# EAGLE design Or'ing (EAGLE 6.5.0)
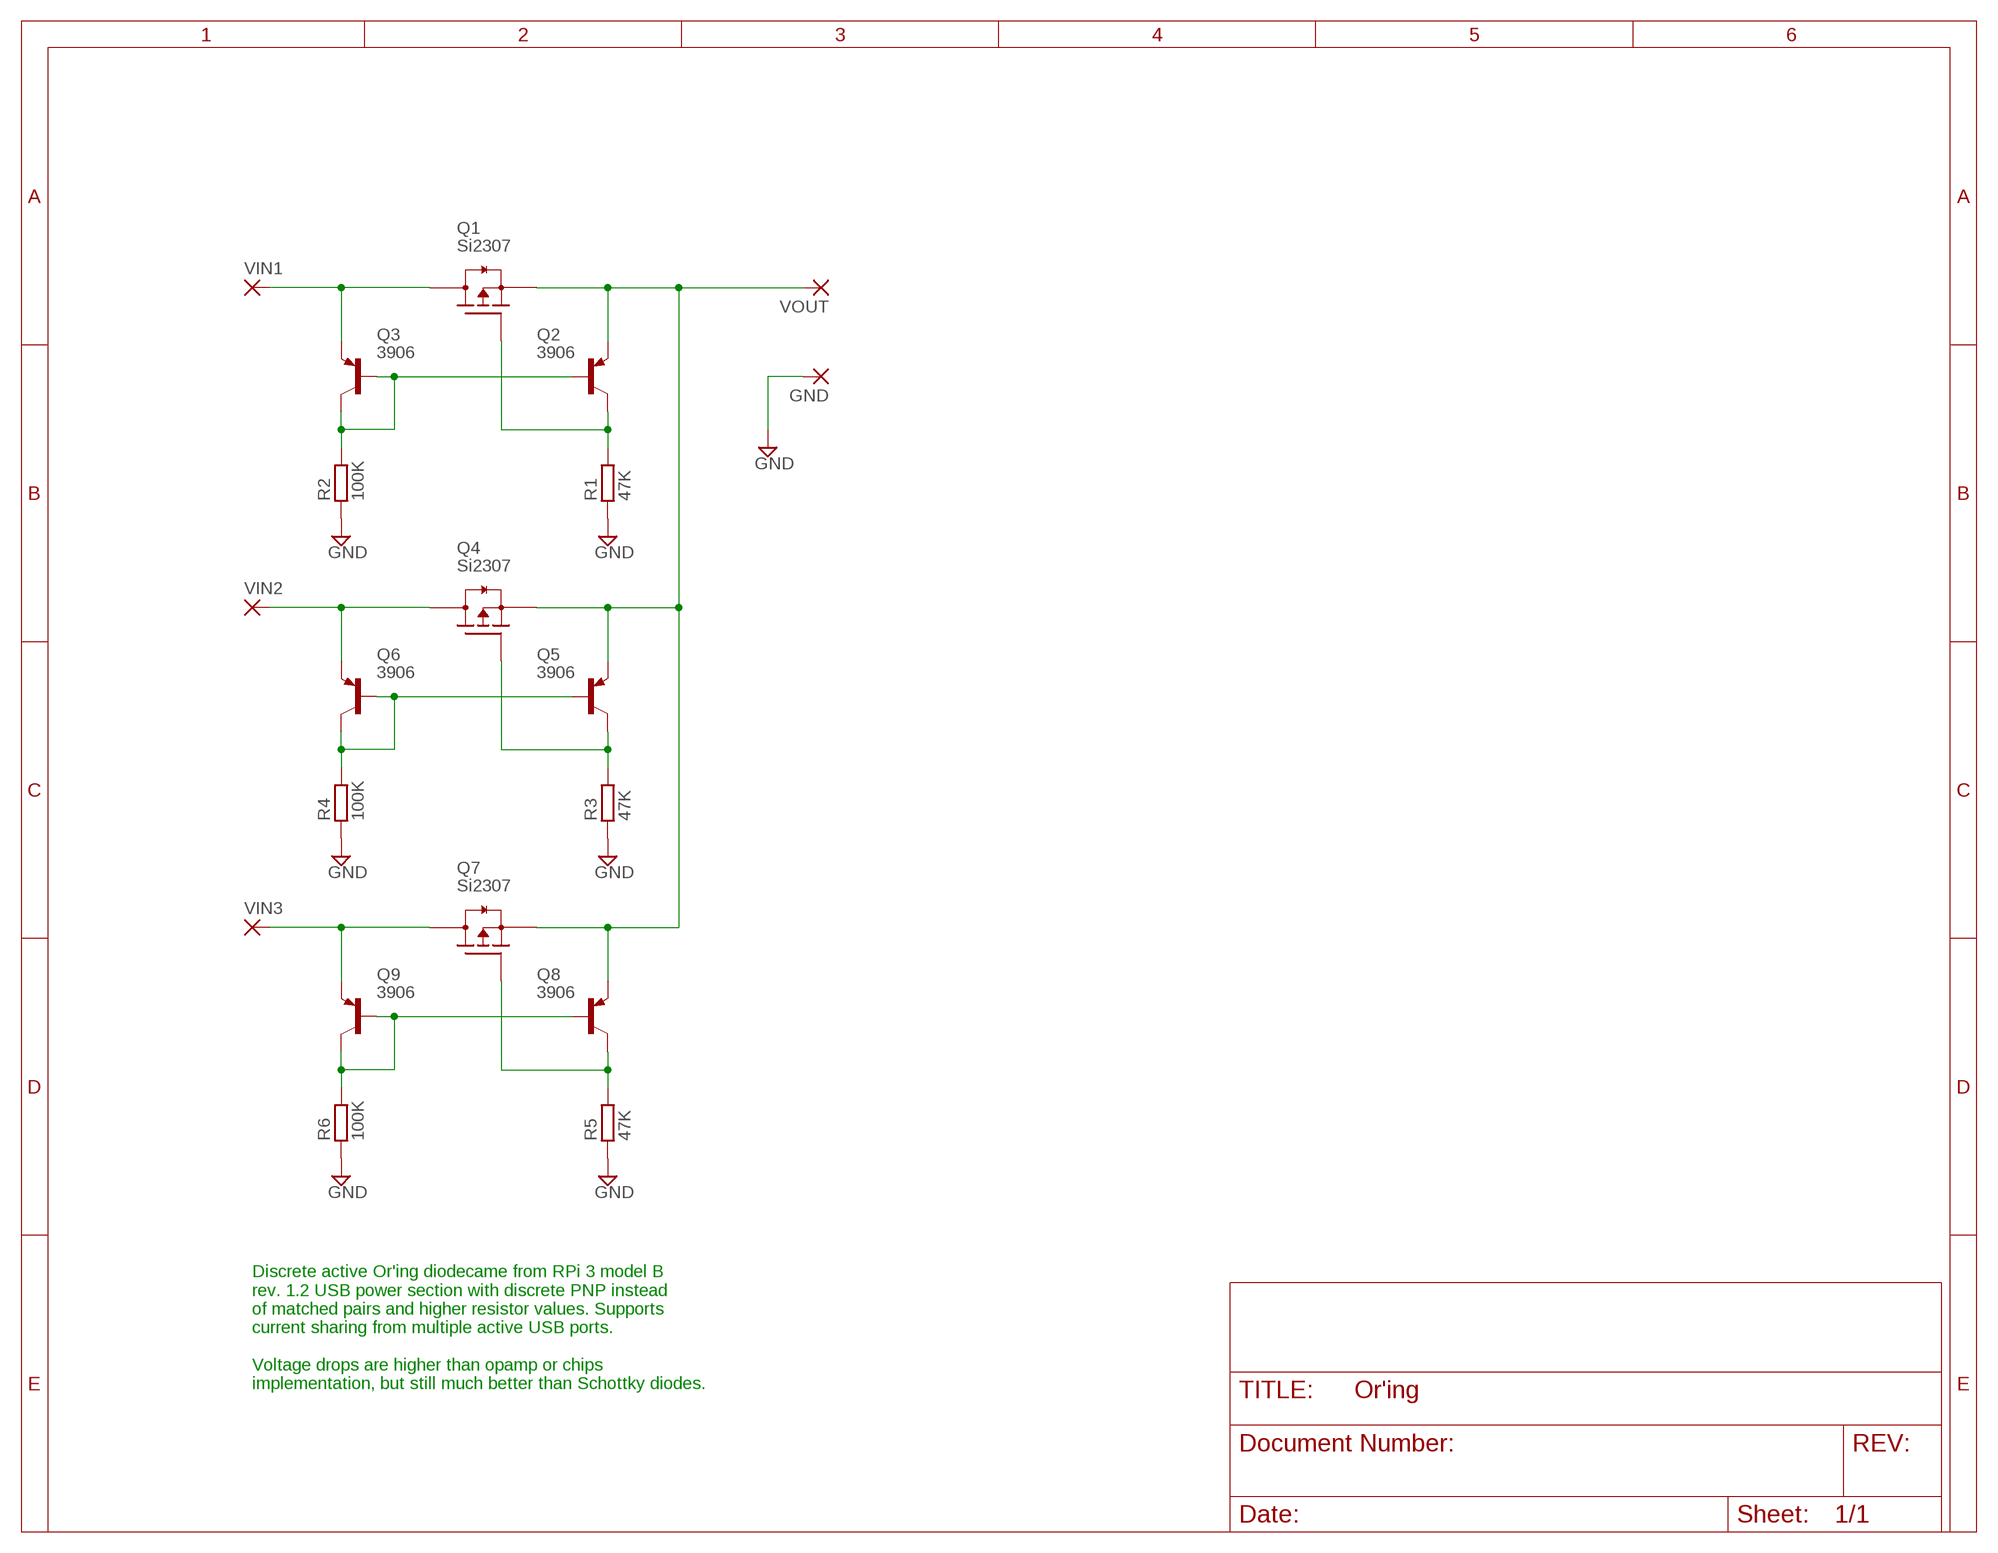
[diagram p0: schematic, sheet 1]

## Parts
GND  SMD2  [SMD1,27-2,54]
Q1  Si2307  MOSFET-PCH_SOT-23  [SOT95P280X135-3N]
Q2  3906  PNP_SOT-23  [SOT95P280X135-3N]
Q3  3906  PNP_SOT-23  [SOT95P280X135-3N]
Q4  Si2307  MOSFET-PCH_SOT-23  [SOT95P280X135-3N]
Q5  3906  PNP_SOT-23  [SOT95P280X135-3N]
Q6  3906  PNP_SOT-23  [SOT95P280X135-3N]
Q7  Si2307  MOSFET-PCH_SOT-23  [SOT95P280X135-3N]
Q8  3906  PNP_SOT-23  [SOT95P280X135-3N]
Q9  3906  PNP_SOT-23  [SOT95P280X135-3N]
R1  47K  RESISTOR_0603  [RESC1608X55N]
R2  100K  RESISTOR_0603  [RESC1608X55N]
R3  47K  RESISTOR_0603  [RESC1608X55N]
R4  100K  RESISTOR_0603  [RESC1608X55N]
R5  47K  RESISTOR_0603  [RESC1608X55N]
R6  100K  RESISTOR_0603  [RESC1608X55N]
VIN1  SMD2  [SMD1,27-2,54]
VIN2  SMD2  [SMD1,27-2,54]
VIN3  SMD2  [SMD1,27-2,54]
VOUT  SMD2  [SMD1,27-2,54]

## Nets
GND: GND.1(P) R1.1 R2.1 R3.1 R4.1 R5.1 R6.1
N$1: Q1.2(S) Q2.2(E) Q4.2(S) Q5.2(E) Q7.2(S) Q8.2(E) VOUT.1(P)
N$2: Q1.3(D) Q3.2(E) VIN1.1(P)
N$3: Q1.1(G) Q2.3(C) R1.2
N$5: Q2.1(B) Q3.1(B) Q3.3(C) R2.2
N$6: Q4.3(D) Q6.2(E) VIN2.1(P)
N$7: Q4.1(G) Q5.3(C) R3.2
N$8: Q5.1(B) Q6.1(B) Q6.3(C) R4.2
N$10: Q7.3(D) Q9.2(E) VIN3.1(P)
N$11: Q7.1(G) Q8.3(C) R5.2
N$12: Q8.1(B) Q9.1(B) Q9.3(C) R6.2

## Notes on the sheet
- Discrete active Or'ing diodecame from RPi 3 model B
  rev. 1.2 USB power section with discrete PNP instead 
  of matched pairs and higher resistor values. Supports
  current sharing from multiple active USB ports.
  
  Voltage drops are higher than opamp or chips 
  implementation, but still much better than Schottky diodes.

## Library data of the parts
GND VIN1-VIN3 VOUT = wirepad:SMD2: SMD PAD
Q1 Q4 Q7 = ipc-7351-transistor:MOSFET-PCH_
Q2 Q3 Q5 Q6 Q8 Q9 = ipc-7351-transistor:PNP_
R1-R6 = ipc-7351-resistor:RESISTOR_

## Board
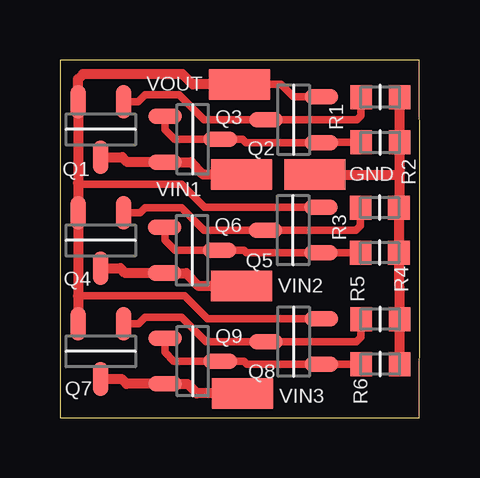
[diagram p1: board, top side]

Size 15.01 x 14.91 mm. Coordinates in mm from the lower left corner, seen from the top.
Outline: 0,0 14.99,0 arc1 14.99,14.91 0,14.91 0,0
Copper layers (1*16): Top 0.035559375mm / dielectric 1.6mm / Bottom 0.035559375mm
Design rules "oshpark-2layer": minimum track width 6mil, minimum drill 10mil, track to track 6mil, track to pad 6mil, pad to pad 6mil, via to via 6mil, smd to smd 6mil, copper to edge 15mil, drill to drill 6mil, minimum pad ring 5mil, minimum via ring 5mil, stop-mask expansion 2.5mil, vias tented up to drill 0mil, thermal gap 10mil

### Footprints (pad centres in the part's own frame; a part is rotated, then mirrored left to right if it is on the bottom)
SMD1,27-2,54 = smd 1.27 x 2.54: 1 0,0
SOT95P280X135-3N = smd 1.4 x 0.65: 1 -1.15,0.95; 2 -1.15,-0.95; 3 1.15,0
RESC1608X55N = smd 0.9 x 1: 1 -0.8,0; 2 0.8,0

### Placement (x,y rotation side)
GND  10.64,10.13 90 top
Q1  1.7,12.01 270 top
Q2  9.75,12.42 180 top
Q3  5.54,11.61 0 top
Q4  1.7,7.39 270 top
Q5  9.73,7.82 180 top
Q6  5.51,6.99 0 top
Q7  1.7,2.77 270 top
Q8  9.75,3.17 180 top
Q9  5.54,2.36 0 top
R1  13.36,13.36 180 top
R2  13.36,11.48 180 top
R3  13.34,8.76 180 top
R4  13.34,6.88 180 top
R5  13.36,4.11 180 top
R6  13.36,2.24 180 top
VIN1  7.57,10.13 90 top
VIN2  7.57,5.49 90 top
VIN3  7.62,1.02 90 top
VOUT  7.49,13.89 90 top

### Tracks (layer width: path | path; a pad name or v marks a point on that pad's centre or on a via)
GND
  Top 0.305: 14.16,8.43 R3.1 14.16,8.79 | 14.13,10.13 14.16,10.16
  Top 0.406: R1.1 R2.1 14.16,10.16 14.16,8.79 | R3.1 R4.1 R5.1 R6.1 | GND.1 14.13,10.13
N$1
  Top 0.305: Q5.2 6.04,8.77 5.08,9.73 0.8,9.73 0.75,9.78 | Q8.2 6.16,4.12 5.21,5.08 0.75,5.08 | Q2.2 9.74,13.37 9.22,13.89 VOUT.1
  Top 0.406: Q7.2 0.75,5.08 Q4.2 0.75,9.78 Q1.2 0.75,14.11 0.96,14.33 5.11,14.33 5.54,13.89 VOUT.1
N$2
  Top 0.406: Q1.3 2.6,10.86 2.8,10.66 Q3.2 5.47,10.66 5.97,10.13 VIN1.1
N$3
  Top 0.305: R1.2 12.56,12.59 12.39,12.42 Q2.3 6.02,12.42 4.98,13.46 3.56,13.46 3.26,13.16 Q1.1
N$5
  Top 0.305: Q3.1 4.39,12 4.78,11.61 Q3.3 7.62,11.61 7.76,11.47 Q2.1 10.91,11.48 R2.2
N$6
  Top 0.406: Q4.3 2.52,6.24 2.73,6.04 Q6.2 5.27,6.04 5.79,5.49 VIN2.1
N$7
  Top 0.305: R3.2 12.54,8.01 12.34,7.82 Q5.3 6.02,7.82 5.08,8.76 3.56,8.76 3.33,8.54 Q4.1
N$8
  Top 0.305: R4.2 10.94,6.88 Q5.1 7.78,6.87 7.67,6.99 Q6.3 4.8,6.99 4.39,7.4 Q6.1
N$10
  Top 0.406: Q7.3 2.57,1.62 2.78,1.41 Q9.2 5.32,1.41 5.71,1.02 VIN3.1
N$11
  Top 0.305: R5.2 12.56,3.37 12.37,3.17 Q8.3 6.1,3.17 5.08,4.19 3.56,4.19 3.28,3.92 Q7.1
N$12
  Top 0.305: R6.2 10.96,2.23 Q8.1 7.81,2.23 7.67,2.36 Q9.3 4.75,2.36 4.39,2.73 Q9.1